# Altium schematic sheet [03] - MAIN FUNC.SchDoc
size A3; DocumentNumber: 3; SheetNumber: 3; SheetTotal: 7
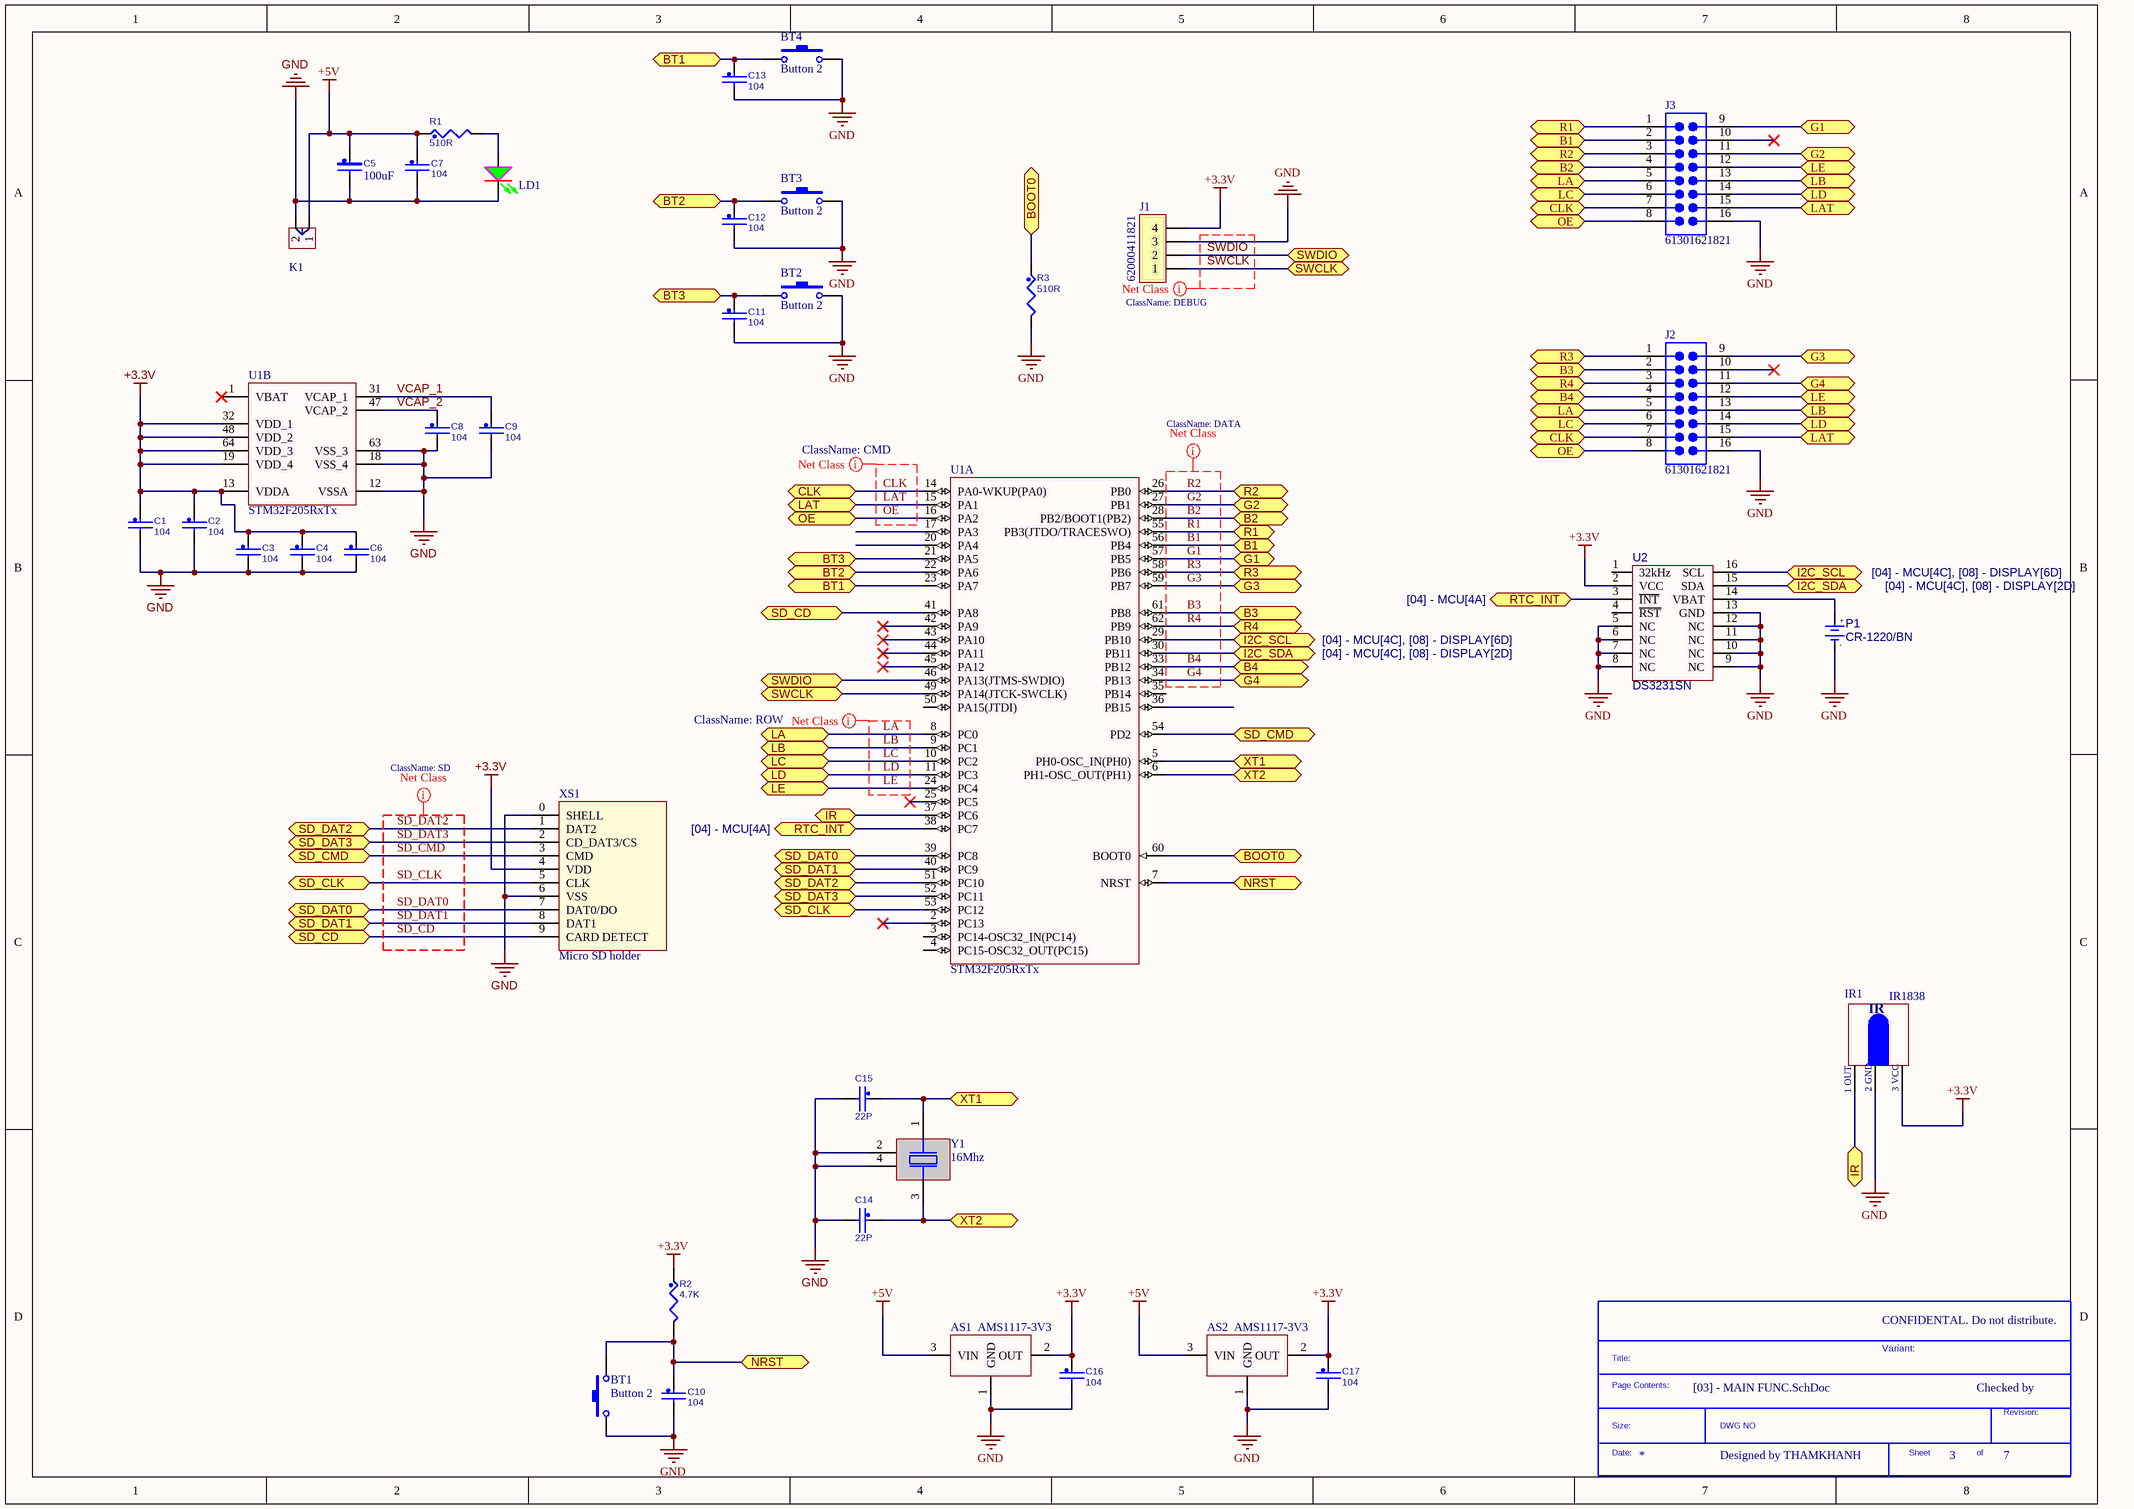
[diagram p0: [03] - MAIN FUNC.SchDoc]

## Parts
*?  SDTitleBlock  (value not drawn)  (graphical)
AS1  AMS1117-3V3  [SOT223-BCE]
AS2  AMS1117-3V3  [SOT223-BCE]
BT1  Button 2  [BT-2P0604B1V]
BT2  Button 2  [BT-2P0606A1V]
BT3  Button 2  [BT-2P0606A1V]
BT4  Button 2  [BT-2P0606A1V]
C1  104  [C0603]
C2  104  [C0603]
C3  104  [C0603]
C4  104  [C0603]
C5  100uF  [CAP-TAN-SMD-3530]
C6  104  [C0603]
C7  104  [C0603]
C8  104  [C0603]
C9  104  [C0603]
C10  104  [C0603]
C11  104  [C0603]
C12  104  [C0603]
C13  104  [C0603]
C14  22P  [C0603]
C15  22P  [C0603]
C16  104  [C0603]
C17  104  [C0603]
IR1  IR1838  [IR RECEIVE V1]
J1  62000411821  [62000411121]
J2  61301621821  [61301621821]
J3  61301621821  [61301621821]
K1  KF2  [KF5.08 2DV]  (value not drawn)
LD1  LED SMD  [LED 0805/2012 BLUE]  (value not drawn)
P1  CR-1220/BN  [PIN-CR1220-SMD-NO]
R1  510R  [R0603]
R2  4.7K  [R0603]
R3  510R  [R0603]
U1  STM32F205RxTx  [QFP50P1000X1000-64N]  (parts A,B of 2)
U2  DS3231SN  [SOIC127P750X1030-16N]
XS1  Micro SD holder  [SD-CARD-MICRO-V3]
Y1  16Mhz  [XT4-2520KC-ABM10]

## Ports
B1 (bidir), B2 (bidir), B3 (bidir), B4 (bidir), BOOT0 (bidir), BT1 (bidir), BT2 (bidir), BT3 (bidir), CLK (bidir), G1 (bidir), G2 (bidir), G3 (bidir), G4 (bidir), I2C_SCL (bidir, see [04] - MCU[4C], [08] - DISPLAY[6D]), I2C_SDA (bidir, see [04] - MCU[4C], [08] - DISPLAY[2D]), IR (bidir), LA (bidir), LAT (bidir), LB (bidir), LC (bidir), LD (bidir), LE (bidir), NRST (bidir), OE (bidir), R1 (bidir), R2 (bidir), R3 (bidir), R4 (bidir), RTC_INT (bidir, see [04] - MCU[4A]), SD_CD (bidir), SD_CLK (bidir), SD_CMD (bidir), SD_DAT0 (bidir), SD_DAT1 (bidir), SD_DAT2 (bidir), SD_DAT3 (bidir), SWCLK (bidir), SWDIO (bidir), XT1 (bidir), XT2 (bidir)

## Nets
+3.3V: AS1.2(OUT) AS2.2(OUT) C1.1 C2.1 C3.1 C4.1 C6.1 C16.1 C17.1 IR1.3(VCC) J1.4 R2.1 U1.13(VDDA) U1.19(VDD_4) U1.32(VDD_1) U1.48(VDD_2) U1.64(VDD_3) U2.2(VCC) XS1.4(VDD)
+5V: AS1.3(VIN) AS2.3(VIN) C5.1 C7.1 K1.1 R1.1
GND: AS1.1(GND) AS2.1(GND) BT1.1 BT2.2 BT3.2 BT4.2 C1.2 C2.2 C3.2 C4.2 C5.2 C6.2 C7.2 C8.2 C9.2 C10.2 C11.2 C12.2 C13.2 C14.2 C15.2 C16.2 C17.2 IR1.2(GND) J1.3 J2.16 J3.16 K1.2 LD1.2(K) P1.2(GND) R3.2 U1.12(VSSA) U1.18(VSS_4) U1.63(VSS_3) U2.5(NC) U2.6(NC) U2.7(NC) U2.8(NC) U2.9(NC) U2.10(NC) U2.11(NC) U2.12(NC) U2.13(GND) XS1.0(SHELL) XS1.6(VSS) Y1.2(GND) Y1.4(GND)
B1: J3.2 U1.56(PB4) ; port B1
B2: J3.4 U1.28(PB2/BOOT1(PB2)) ; port B2
B3: J2.2 U1.61(PB8) ; port B3
B4: J2.4 U1.33(PB12) ; port B4
BOOT0: R3.1 U1.60(BOOT0) ; port BOOT0
BT1: BT4.1 C13.1 U1.23(PA7) ; port BT1
BT2: BT3.1 C12.1 U1.22(PA6) ; port BT2
BT3: BT2.1 C11.1 U1.21(PA5) ; port BT3
CLK: J2.7 J3.7 U1.14(PA0-WKUP(PA0)) ; port CLK
G1: J3.9 U1.57(PB5) ; port G1
G2: J3.11 U1.27(PB1) ; port G2
G3: J2.9 U1.59(PB7) ; port G3
G4: J2.11 U1.34(PB13) ; port G4
I2C_SCL: U1.29(PB10) U2.16(SCL) ; port I2C_SCL
I2C_SDA: U1.30(PB11) U2.15(SDA) ; port I2C_SDA
IR: IR1.1(Out) U1.37(PC6) ; port IR
LA: J2.5 J3.5 U1.8(PC0) ; port LA
LAT: J2.15 J3.15 U1.15(PA1) ; port LAT
LB: J2.13 J3.13 U1.9(PC1) ; port LB
LC: J2.6 J3.6 U1.10(PC2) ; port LC
LD: J2.14 J3.14 U1.11(PC3) ; port LD
LE: J2.12 J3.12 U1.24(PC4) ; port LE
NRST: BT1.2 C10.1 R2.2 U1.7(NRST) ; port NRST
OE: J2.8 J3.8 U1.16(PA2) ; port OE
R1: J3.1 U1.55(PB3(JTDO/TRACESWO)) ; port R1
R2: J3.3 U1.26(PB0) ; port R2
R3: J2.1 U1.58(PB6) ; port R3
R4: J2.3 U1.62(PB9) ; port R4
RTC_INT: U1.38(PC7) U2.3(~{INT}) ; port RTC_INT
SD_CD: U1.41(PA8) XS1.9(CARD_DETECT) ; port SD_CD
SD_CLK: U1.53(PC12) XS1.5(CLK) ; port SD_CLK
SD_CMD: U1.54(PD2) XS1.3(CMD) ; port SD_CMD
SD_DAT0: U1.39(PC8) XS1.7(DAT0/DO) ; port SD_DAT0
SD_DAT1: U1.40(PC9) XS1.8(DAT1) ; port SD_DAT1
SD_DAT2: U1.51(PC10) XS1.1(DAT2) ; port SD_DAT2
SD_DAT3: U1.52(PC11) XS1.2(CD_DAT3/CS) ; port SD_DAT3
SWCLK: J1.1 U1.49(PA14(JTCK-SWCLK)) ; port SWCLK
SWDIO: J1.2 U1.46(PA13(JTMS-SWDIO)) ; port SWDIO
VCAP_1: C9.1 U1.31(VCAP_1)
VCAP_2: C8.1 U1.47(VCAP_2)
XT1: C15.1 U1.5(PH0-OSC_IN(PH0)) Y1.1(X1) ; port XT1
XT2: C14.1 U1.6(PH1-OSC_OUT(PH1)) Y1.3(X2) ; port XT2
NetLD1_1: LD1.1(A) R1.2
NetP1_1: P1.1(+3V) U2.14(VBAT)

Not connected (* = marked no-connect by the designer): J2 10*; J3 10*; U1 1(VBAT)* 2(PC13)* 3(PC14-OSC32_IN(PC14)) 4(PC15-OSC32_OUT(PC15)) 17(PA3) 20(PA4) 25(PC5)* 35(PB14) 36(PB15) 42(PA9)* 43(PA10)* 44(PA11)* 45(PA12)* 50(PA15(JTDI)); U2 1(32kHz) 4(~{RST})

## Layout directives
net class SD: SD_CD, SD_CLK, SD_CMD, SD_DAT0, SD_DAT1, SD_DAT2, SD_DAT3
net class DATA: B1, B2, B3, B4, G1, G2, G3, G4, R1, R2, R3, R4
net class ROW: LA, LB, LC, LD, LE
net class CMD: CLK, LAT, OE
net class DEBUG: SWCLK, SWDIO

## Notes on the sheet
- CONFIDENTAL. Do not distribute.
- Variant:
- Checked by
- Designed by THAMKHANH
- (in symbol IR1838) IR; 1 OUT; 2 GND; 3 VCC
- (in symbol PIN-CR-1220/BN) +; -
- (in symbol SDTitleBlock) Title:; Page Contents:; Revision:; Size:; DWG NO; Date:; Sheet; of

## Library data of the parts
AS1 AS2 = AMS1117-3V3: 800mA Low-Dropout Linear Regulator
BT1-BT4 = Button 2: Button 2 Pin no Sheld
C1-C4 C6-C17 = CAP-SMD-CERAMIC: Surface Mound Multilayer Ceramic Chip Capacitor (SMD MLCC); Manufacturer: TDK Corporation; Manufacturer Part Number: C2012X5R1C226K; Capacitance: 22pF; Voltage - Rated: 16V; Tolerance: ±10%; Temperature Coefficient: X5R; .Checked PCB: RF; RoHS: RoHS Compliant; Category: Capacitors; Mounting Type: Surface Mount, MLCC; Operating Temperature: -55°C ~ 85°C; Applications: General Purpose; Ratings: -; Package / Case: 0805 (2012 Metric); Size / Dimension: 0.079" L x 0.049" W (2.00mm x 1.25mm); Height - Seated (Max): -; Thickness (Max): 0.057" (1.45mm); Lead Spacing: -; Features: -; Packaging: Cut Tape (CT); Lead Style: -; ComponentLink1URL: http://www.tdk.com/pdf/general_B11.pdf; ComponentLink1Description: http://www.tdk.com/pdf/general_B11.pdf; .Checked SCH: RF
C5 = CAP-SMD-TANTALUM: Tantalum capacitor , T491A475K016AT, KEMET; Manufacturer Part Number: T491A105K016AT; Capacitance: 1uF; Tolerance: 20%; Voltage Rating: 16V; ESR (Equivalent Series Resistance): 10R; Leakage Current: 500nA; Polarity: Polar; Dissipation Factor: 4%; Life (Hours): 2000Hour; Ripple Current: 87mA; Manufacturer: KEMET; Mount: Surface Mount,PCB; Case/Package: 1206; Number of Pins: 2; Case Code (Imperial): 1206; Case Code (Metric): 3216; Dielectric Material: Tantalum; Min Operating Temperature: -55°C; Max Operating Temperature: 125°C; Packaging: Tape and Reel; Package Quantity: 1; Voltage Rating (DC): 16V; Termination: SMD/SMT; Voltage: 16V; Features: General Purpose; Length: 3.2mm; Height: 1.6mm; Width: 1.6mm; Height - Seated (Max): 0.071inch; Depth: 1.6mm; REACH SVHC: No SVHC; Lead Free: Lead Free; ComponentLink1URL: https://4donline.ihs.com/images/VipMasterIC/IC/KEME/KEME-S-A0006487387/KEME-S-A0006487387-1.pdf?hkey=52A5661711E402568146F3353EA87419&src-supplier=Element14; ComponentLink1Description: https://4donline.ihs.com/images/VipMasterIC/IC/KEME/KEME-S-A0006487387/KEME-S-A0006487387-1.pdf?hkey=52A5661711E402568146F3353EA87419&src-supplier=Element14; ComponentLink2URL: http://www.rapidonline.com/pdf/458280_da_en_01.pdf?src-supplier=Rapid+Electronics; ComponentLink2Description: http://www.rapidonline.com/pdf/458280_da_en_01.pdf?src-supplier=Rapid+Electronics; ComponentLink3URL: http://www.jameco.com/Jameco/Products/ProdDS/1573169.pdf?src-supplier=Jameco; ComponentLink3Description: http://www.jameco.com/Jameco/Products/ProdDS/1573169.pdf?src-supplier=Jameco; ComponentLink4URL: http://www.kemet.com/kemet/web/homepage/kechome.nsf/file/T491%20Series/$file/KEM_T2005_T491.pdf?src-supplier=Farnell; ComponentLink4Description: http://www.kemet.com/kemet/web/homepage/kechome.nsf/file/T491%20Series/$file/KEM_T2005_T491.pdf?src-supplier=Farnell; ComponentLink5URL: http://www.mouser.com/ds/2/212/KEM_T2005_T491-1093550.pdf?src-supplier=Mouser; ComponentLink5Description: http://www.mouser.com/ds/2/212/KEM_T2005_T491-1093550.pdf?src-supplier=Mouser; ComponentLink6URL: https://www.distrelec.biz/Web/Downloads/_t/ds/KEM_T2005_T491_eng_tds.pdf?mime=application%2Fpdf&src-supplier=Distrelec; ComponentLink6Description: https://www.distrelec.biz/Web/Downloads/_t/ds/KEM_T2005_T491_eng_tds.pdf?mime=application%2Fpdf&src-supplier=Distrelec; ComponentLink7URL: https://api.kemet.com/component-edge/download/datasheet/T491A105K016AT.pdf?src-supplier=Digi-Key; ComponentLink7Description: https://api.kemet.com/component-edge/download/datasheet/T491A105K016AT.pdf?src-supplier=Digi-Key; ComponentLink8URL: http://www.kemet.com/kemet/web/homepage/kechome.nsf/file/T491%20Series/$file/KEM_T2005_T491.pdf?src-supplier=Element14; ComponentLink8Description: http://www.kemet.com/kemet/web/homepage/kechome.nsf/file/T491%20Series/$file/KEM_T2005_T491.pdf?src-supplier=Element14; ComponentLink9URL: http://uk.rs-online.com/webdocs/1529/0900766b815290c9.pdf?src-supplier=RSComponents; ComponentLink9Description: http://uk.rs-online.com/webdocs/1529/0900766b815290c9.pdf?src-supplier=RSComponents; ComponentLink10URL: https://www.alliedelec.com/m/d/1172a60f7bb3eb66344f86e8fb9ddbde.pdf?src-supplier=Allied+Electronics; ComponentLink10Description: https://www.alliedelec.com/m/d/1172a60f7bb3eb66344f86e8fb9ddbde.pdf?src-supplier=Allied+Electronics; Radiation Hardening: No; ComponentLink11URL: https://api.kemet.com/component-edge/download/datasheet/T491A475K016AT.pdf?src-supplier=Digi-Key; ComponentLink11Description: https://api.kemet.com/component-edge/download/datasheet/T491A475K016AT.pdf?src-supplier=Digi-Key; ComponentLink12URL: http://www.jameco.com/Jameco/Products/ProdDS/1573425.pdf?src-supplier=Jameco; ComponentLink12Description: http://www.jameco.com/Jameco/Products/ProdDS/1573425.pdf?src-supplier=Jameco; ComponentLink13URL: http://uk.rs-online.com/webdocs/1515/0900766b81515525.pdf?src-supplier=RSComponents; ComponentLink13Description: http://uk.rs-online.com/webdocs/1515/0900766b81515525.pdf?src-supplier=RSComponents; ComponentLink14URL: http://www.farnell.com/datasheets/1854511.pdf?src-supplier=Element14; ComponentLink14Description: http://www.farnell.com/datasheets/1854511.pdf?src-supplier=Element14; ComponentLink15URL: http://www.rapidonline.com/pdf/458253_da_en_01.pdf?src-supplier=Rapid+Electronics; ComponentLink15Description: http://www.rapidonline.com/pdf/458253_da_en_01.pdf?src-supplier=Rapid+Electronics; ComponentLink16URL: https://produktinfo.conrad.com/datenblaetter/450000-474999/458253-da-01-en-TANTAL_KONDENSATOR_T491A475K016AT.pdf?src-supplier=Conrad; ComponentLink16Description: https://produktinfo.conrad.com/datenblaetter/450000-474999/458253-da-01-en-TANTAL_KONDENSATOR_T491A475K016AT.pdf?src-supplier=Conrad
IR1 = IR1838: VISHAY SEMICONDUCTOR   TSOP31238   IR RECEIVER, 40M, 38KHZ, SIP
J1 = JP4 2.00MM Single Socket: WR-PHD 2.00 mm Socket Header; Manufacturer: W¨¹rth Elektronik eiSos GmbH; ComponentLink1 Description: Manufacturer; ComponentLink2 Description: Datasheet; NoPins: 04; Created Date: 2 April 2013; partNo: 62000411821; ComponentLink1URL: http://www.we-online.com; ComponentLink2URL: http://katalog.we-online.de/em/datasheet/6200xx11821.pdf; Created by: Karrer Zheng
J2 J3 = JP8 2.54MM Dual Socket: 2.54 mm Dual Socket Header, 16p; PublishedDate: July 2016; Publisher: Wurth Elektronik; ComponentLink1Description: Manufacturer; ComponentLink1URL: http://www.we-online.de; ComponentLink2Description: Datasheet; ComponentLink2URL: http://katalog.we-online.de/em/datasheet/6130xx21821.pdf; PartNumber: 61301621821; PinNumber: 16p
K1 = KF2: KF2, 5.08mm, 10A, 300V, -40C ~ 105C
LD1 = LED SMD: LED DIFFUSED SMD
P1 = PIN-CR-1220/BN: PANASONIC - CR-1220/BN - BATTERY, LITHIUM, CR1220; Capacity: 35mAh; Voltage Rating (DC): 3V; Outside Diameter: 12.5mm; Manufacturer: Panasonic; Manufacturer Part Number: CR-1220/BN; Weight: 1.2g; Min Operating Temperature: -30°C; Max Operating Temperature: 60°C; Chemistry/Technology: Lithium; Termination: Standard; Diameter: 12.5mm; Height: 2mm; Lead Free: Lead Free; REACH SVHC: Yes; ComponentLink1URL: http://uk.rs-online.com/webdocs/0c85/0900766b80c85259.pdf?src-supplier=RSComponents; ComponentLink1Description: http://uk.rs-online.com/webdocs/0c85/0900766b80c85259.pdf?src-supplier=RSComponents
R1-R3 = RES-SMD: RES 0R OHM 1/8W 1% SMD; Manufacturer: Yageo; Manufacturer Part Number: RC0402FR-0749R9L; Power (Watts): 0.063W, 1/16W; .Checked PCB: used; Temperature Coefficient: ±100ppm/°C; Resistance: 3.3kR; Power Rating: 125mW; Voltage Rating: 100V; Category: Resistors; Supplier Part Number: 311-49.9LRCT-ND; Package / Case: 0402 (1005 Metric); Price 1k [$]: 0.01421; Tolerance: ±1%; Value: 0R; .Checked SCH: used; Supplier: Digikey; RoHS: RoHS Compliant; Composition: Thick Film; Features: -; Size / Dimension: 0.039" L x 0.020" W (1.00mm x 0.50mm); Height: 0.016" (0.40mm); Number of Terminations: 2; Packaging: Cut Tape (CT); ComponentLink1URL: http://www.yageo.com/documents/recent/PYu-RC0402_51_RoHS_L_6.pdf; ComponentLink1Description: http://www.yageo.com/documents/recent/PYu-RC0402_51_RoHS_L_6.pdf; Resistance (Ohms): 0R; Mount: Surface Mount; Case/Package: 0805; Number of Pins: 2; Contact Plating: Tin; Case Code (Metric): 2012; Case Code (Imperial): 0805; Min Operating Temperature: -55°C; Max Operating Temperature: 155°C; Package Quantity: 1; Termination: SMD/SMT; Military Standard: Not; Max Power Dissipation: 125mW; Voltage Rating (DC): 100V; Length: 2mm; Width: 1.25mm; Depth: 1.25mm; Radiation Hardening: No; REACH SVHC: No SVHC; Lead Free: Lead Free; ComponentLink2URL: http://www.farnell.com/datasheets/485442.pdf?src-supplier=Farnell; ComponentLink2Description: http://www.farnell.com/datasheets/485442.pdf?src-supplier=Farnell; ComponentLink3URL: http://uk.rs-online.com/webdocs/0bee/0900766b80beefcc.pdf?src-supplier=RSComponents; ComponentLink3Description: http://uk.rs-online.com/webdocs/0bee/0900766b80beefcc.pdf?src-supplier=RSComponents; ComponentLink4URL: http://industrial.panasonic.com/www-data/pdf/AOA0000/AOA0000CE26.pdf?src-supplier=Future+Electronics; ComponentLink4Description: http://industrial.panasonic.com/www-data/pdf/AOA0000/AOA0000CE26.pdf?src-supplier=Future+Electronics; ComponentLink5URL: https://www.alliedelec.com/m/d/b6b0537e86f421aa7f5975bb1d8f429a.pdf?src-supplier=Allied+Electronics; ComponentLink5Description: https://www.alliedelec.com/m/d/b6b0537e86f421aa7f5975bb1d8f429a.pdf?src-supplier=Allied+Electronics; ComponentLink6URL: http://industrial.panasonic.com/www-data/pdf/AOA0000/AOA0000CE26.pdf?src-supplier=Avnet; ComponentLink6Description: http://industrial.panasonic.com/www-data/pdf/AOA0000/AOA0000CE26.pdf?src-supplier=Avnet; ComponentLink7URL: http://industrial.panasonic.com/www-data/pdf/AOA0000/AOA0000CE26.pdf?src-supplier=Avnet+Europe; ComponentLink7Description: http://industrial.panasonic.com/www-data/pdf/AOA0000/AOA0000CE26.pdf?src-supplier=Avnet+Europe; ComponentLink8URL: http://industrial.panasonic.com/cdbs/www-data/pdf/RDM0000/AOA0000C307.pdf?src-supplier=Farnell; ComponentLink8Description: http://industrial.panasonic.com/cdbs/www-data/pdf/RDM0000/AOA0000C307.pdf?src-supplier=Farnell; ComponentLink9URL: https://www.distrelec.biz/Web/Downloads/_t/ds/ERA_eng_tds.pdf?mime=application%2Fpdf&src-supplier=Distrelec; ComponentLink9Description: https://www.distrelec.biz/Web/Downloads/_t/ds/ERA_eng_tds.pdf?mime=application%2Fpdf&src-supplier=Distrelec; ComponentLink10URL: http://www.farnell.com/datasheets/485442.pdf?src-supplier=Element14; ComponentLink10Description: http://www.farnell.com/datasheets/485442.pdf?src-supplier=Element14; ComponentLink11URL: http://www.farnell.com/datasheets/2052875.pdf?src-supplier=Farnell; ComponentLink11Description: http://www.farnell.com/datasheets/2052875.pdf?src-supplier=Farnell; ComponentLink12URL: http://www.farnell.com/datasheets/2059650.pdf?src-supplier=Farnell; ComponentLink12Description: http://www.farnell.com/datasheets/2059650.pdf?src-supplier=Farnell; ComponentLink13URL: https://produktinfo.conrad.com/datenblaetter/450000-474999/453184-da-01-en-WIDERSTAND_0805_ERA.pdf?src-supplier=Conrad; ComponentLink13Description: https://produktinfo.conrad.com/datenblaetter/450000-474999/453184-da-01-en-WIDERSTAND_0805_ERA.pdf?src-supplier=Conrad
U1 = STM32F205RxTx: ARM Cortex-M3 32-bit MCU, 1024 KB Flash, 128 KB Internal RAM, 51 I/Os, 64-pin LQFP, -40 to 105 degC, Tray; PartNumber: STM32F205RGT7; D/A Converter: 2x12-bit (2 Channel); FLASH Size (Prog) (kB): 1024; I/Os (High Current): 51; Internal RAM Size (kB): 128; Operating Frequency(F) (Processor speed) (MHz): 120; Supply Voltage(Vcc) min (V): 1.8; DatasheetVersion: Rev. 9; PackageVersion: Rev. 4, 06/2013; PackageReference: LQFP64; PackageDescription: 64-Pin Low Profile Quad Flat Package, 10 x 10 mm Body, 0.5 mm Pitch; Core: ARM Cortex-M3; Packing: Tray; Mounting Technology: Surface Mount; ComponentLink1Description: Manufacturer URL; ComponentLink1URL: http://www.st.com/web/en/home.html; ComponentLink2Description: Datasheet; ComponentLink2URL: http://www.st.com/st-web-ui/static/active/en/resource/technical/document/datasheet/CD00237391.pdf; ComponentLink3Description: Package Specification; ComponentLink3URL: http://www.st.com/st-web-ui/static/active/en/resource/technical/document/datasheet/DM00037051.pdf
U2 = DS3231SN: RTC, TCXO, CRYSTAL, 3.3V, 16SOIC; Manufacturer: Maxim; Max Supply Voltage: 5.5V; Min Supply Voltage: 2.3V; Logic Function: Clock; Time Format: HH:MM:SS; Date Format: YY-MM-DD-dd; Interface: I2C,Serial,2-Wire; Number of Outputs: 1; Frequency: 32.768kHz; Manufacturer Part Number: DS3231SN; Mount: Surface Mount; Case/Package: SOIC; Number of Pins: 16; Weight: 0.023492oz; Min Operating Temperature: -40°C; Max Operating Temperature: 85°C; Package Quantity: 46; Packaging: Bulk; Operating Supply Voltage: 3.3V; Termination: SMD/SMT; Length: 10.5mm; Height: 2.35mm; Width: 7.6mm; Radiation Hardening: No; REACH SVHC: Unknown; Lead Free: Lead Free; ComponentLink1URL: https://datasheets.maximintegrated.com/en/ds/DS3231-DS3231S.pdf?src-supplier=Digi-Key; ComponentLink1Description: https://datasheets.maximintegrated.com/en/ds/DS3231-DS3231S.pdf?src-supplier=Digi-Key; ComponentLink2URL: http://datasheets.maxim-ic.com/en/ds/DS3231.pdf?src-supplier=Avnet+Europe; ComponentLink2Description: http://datasheets.maxim-ic.com/en/ds/DS3231.pdf?src-supplier=Avnet+Europe; ComponentLink3URL: http://www.farnell.com/datasheets/1675711.pdf?src-supplier=Element14; ComponentLink3Description: http://www.farnell.com/datasheets/1675711.pdf?src-supplier=Element14; ComponentLink4URL: http://www.mouser.com/ds/2/256/DS3231-102175.pdf?src-supplier=Mouser; ComponentLink4Description: http://www.mouser.com/ds/2/256/DS3231-102175.pdf?src-supplier=Mouser; ComponentLink5URL: http://datasheets.maximintegrated.com/en/ds/DS3231.pdf?src-supplier=Avnet; ComponentLink5Description: http://datasheets.maximintegrated.com/en/ds/DS3231.pdf?src-supplier=Avnet; ComponentLink6URL: http://datasheet.iiic.cc/maxim/DS3231SN_.pdf?src-supplier=IIIC; ComponentLink6Description: http://datasheet.iiic.cc/maxim/DS3231SN_.pdf?src-supplier=IIIC
XS1 = SD-CARD-v3
Y1 = XT4A: XMHz ±30ppm Crystal 20pF 150 Ohm -20°C ~ 70°C  Surface Mount HC49/US; Manufacturer: Abracon; Manufacturer Part Number: ABM8-24.000MHZ-B2-T; ESR (Equivalent Series Resistance): 50R; Frequency: 24MHz; Load Capacitance: 18pF; Tolerance: 20ppm; Frequency Stability: 50ppm; Mount: Surface Mount; Case/Package: CSMD; Number of Pins: 4; Min Operating Temperature: -20°C; Max Operating Temperature: 70°C; Package Quantity: 1000; Packaging: Tape and Reel; Frequency Tolerance: 20ppm; Termination: SMD/SMT; Series Resistance: 50R; Composition: Ceramic; Accuracy: 20ppm; Length: 3.2mm; Height: 0.031inch; Depth: 2.5mm; Width: 2.5mm; Radiation Hardening: No; REACH SVHC: No SVHC; Lead Free: Lead Free; ComponentLink1URL: http://www.mouser.com/ds/2/3/abm8-16794.pdf?src-supplier=Mouser; ComponentLink1Description: http://www.mouser.com/ds/2/3/abm8-16794.pdf?src-supplier=Mouser; ComponentLink2URL: http://www.farnell.com/datasheets/97450.pdf?src-supplier=Element14; ComponentLink2Description: http://www.farnell.com/datasheets/97450.pdf?src-supplier=Element14; ComponentLink3URL: http://www.abracon.com/Resonators/abm8.pdf?src-supplier=Element14; ComponentLink3Description: http://www.abracon.com/Resonators/abm8.pdf?src-supplier=Element14; ComponentLink4URL: https://www.verical.com/server-webapp/html/getDatasheet?partID=719846&src-supplier=Verical; ComponentLink4Description: https://www.verical.com/server-webapp/html/getDatasheet?partID=719846&src-supplier=Verical; ComponentLink5URL: https://abracon.com/Support/PackageDrawing/Resonators/ABM8.PDF?src-supplier=Digi-Key; ComponentLink5Description: https://abracon.com/Support/PackageDrawing/Resonators/ABM8.PDF?src-supplier=Digi-Key; ComponentLink6URL: http://www.abracon.com/Resonators/abm8.pdf?src-supplier=Digi-Key; ComponentLink6Description: http://www.abracon.com/Resonators/abm8.pdf?src-supplier=Digi-Key; ComponentLink7URL: http://www.abracon.com/Resonators/abm8.pdf?src-supplier=Future+Electronics; ComponentLink7Description: http://www.abracon.com/Resonators/abm8.pdf?src-supplier=Future+Electronics; ComponentLink8URL: http://www.abracon.com/Resonators/abm8.pdf?src-supplier=Farnell; ComponentLink8Description: http://www.abracon.com/Resonators/abm8.pdf?src-supplier=Farnell